# EAGLE design pierce-test-board5 (EAGLE 6.5.0)
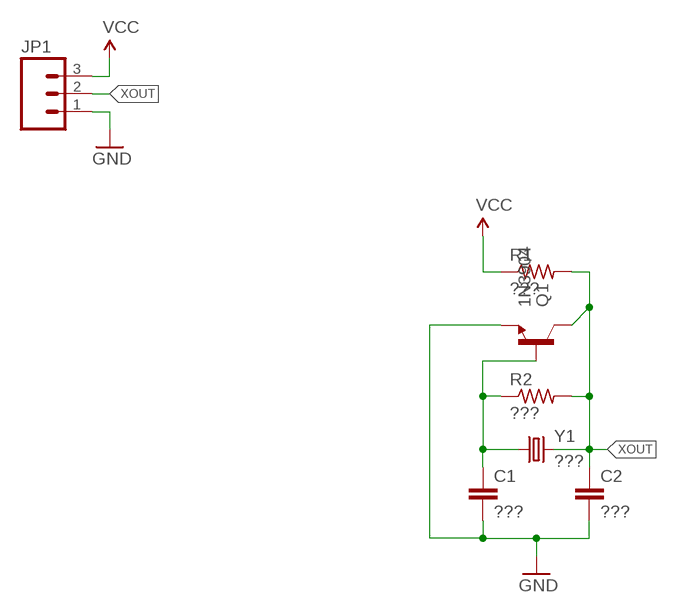
[diagram p0: schematic, sheet 1]

## Parts
C1  ???  CAPACITOR-CERAMIC025-024X044  [C025-024X044]
C2  ???  CAPACITOR-CERAMIC025-024X044  [C025-024X044]
JP1  M03PTH  [1X03]
Q1  1N3904  TRANSISTOR_NPNTO-92-AMMO-EBC  [TO-92-AMMO]
R1  ???  RESISTORPTH-AXIAL-5.08MM  [RESISTOR-AXIAL-PTH-5.08MM]
R2  ???  RESISTORPTH-AXIAL-5.08MM  [RESISTOR-AXIAL-PTH-5.08MM]
Y1  ???  CRYSTALHC49UV  [HC49U-V]

## Nets
GND: C1.2 C2.2 JP1.1 Q1.1(E)
N$2: C1.1 Q1.2(B) R2.P$1 Y1.1
VCC: JP1.3 R1.P$1
XOUT: C2.1 JP1.2 Q1.3(C) R1.P$2 R2.P$2 Y1.2

## Library data of the parts
C1 C2 = A_butts:CAPACITOR-CERAMIC: CAPACITOR, European symbol
JP1 = A_butts:M03: Header 3 Standard 3-pin 0.1" header. Use with straight break away headers (SKU : PRT-00116), right angle break away headers (PRT-00553), swiss pins (PRT-00743), machine pins (PRT-00117), and female headers (PRT-00115). Molex polarized connector foot print use with SKU : PRT-08232 with associated crimp pins and housings.
Q1 = A_butts:TRANSISTOR_NPN: Generic NPN BJT MMBT2222A - TRANS-08049 (SOT-23, 1A 40V) MPSA42 - TRANS-09116 (SOT-23, 500mA 300V) MMBT5088LT1G - TRANS-11160 (SOT-23, 50 mA 30V) BC547 - COM-08928 <http://www.sparkfun.com/products/8928> (TO-92 45V 100mA) (1.Collector 2.Base 3.Emitter) 2N3904 - COM-00521 <http://www.sparkfun.com/products/521> (TO-92 40V 200mA) (1.Emitter 2.Base 3.Collector) P2N2222A - COM-12852 <http://www.sparkfun.com/products/12852> (TO-92 40V 600mA) (1.Collector 2.Base 3.Emitter)
R1 R2 = A_butts:RESISTOR: RESISTOR, American symbol
Y1 = A_butts:CRYSTAL: Various standard crystals. Proven footprints. Spark Fun Electronics SKU : COM-00534

## Board
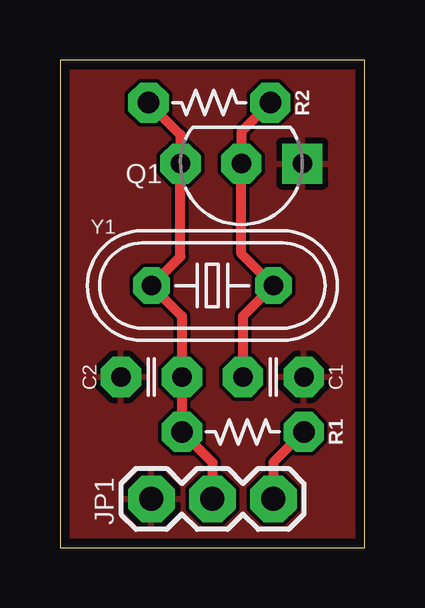
[diagram p1: board, top side]
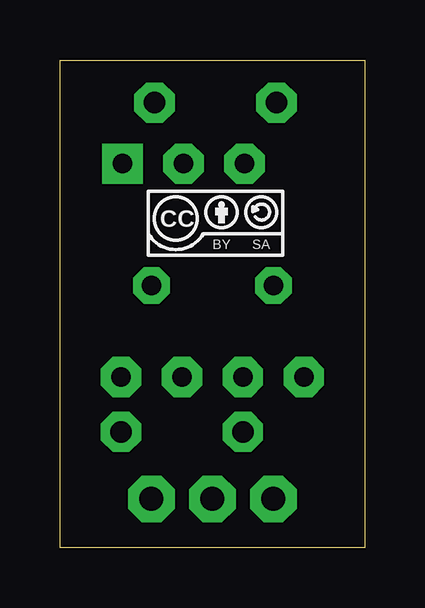
[diagram p2: board, bottom side, seen from below]

Size 12.7 x 20.32 mm. Coordinates in mm from the lower left corner, seen from the top.
Outline: 0,0 12.7,0 12.7,20.32 0,20.32 0,0
Copper layers (1*16): Top 0.0356mm / dielectric 1.5011mm / Bottom 0.0356mm
Design rules "LaenPCBOrder_2": minimum track width 6mil, minimum drill 13mil, track to track 6mil, track to pad 6mil, pad to pad 6mil, via to via 6mil, smd to smd 6mil, copper to edge 15mil, drill to drill 6mil, minimum pad ring 7mil, minimum via ring 7mil, stop-mask expansion 3mil, vias tented up to drill 20mil, thermal gap 10mil

### Footprints (pad centres in the part's own frame; a part is rotated, then mirrored left to right if it is on the bottom)
C025-024X044 = drill 0.813 pad 1.676 octagon: 1 -1.27,0; 2 1.27,0
1X03 = drill 1 pad 1.93 octagon: 1 0,0; 2 2.54,0; 3 5.08,0
TO-92-AMMO = drill 0.813 pad 1.676 square: 1 -2.54,0 | drill 0.813 pad 1.676 octagon: 2 0,0; 3 2.54,0
RESISTOR-AXIAL-PTH-5.08MM = drill 0.9 pad 1.676 octagon: P$1 -2.54,0; P$2 2.54,0
HC49U-V = drill 0.813 pad 1.524 octagon: 1 -2.54,0; 2 2.54,0

### Placement (x,y rotation side)
C1  8.89,7.11 0 top
C2  3.81,7.11 180 top
JP1  3.81,2.03 0 top
Q1  7.56,16 180 top
R1  7.62,4.83 180 top
R2  6.22,18.54 180 top
U$1  [CC-BY-SA-4.0-NO-URL]  7.87,13.72 0 bottom
Y1  6.35,10.92 180 top

### Tracks (layer width: path | path; a pad name or v marks a point on that pad's centre or on a via)
GND
  pour Top: 0,0 0,20.32 12.7,20.32 12.7,0
N$2
  Top 0.406: R2.P$1 7.56,17.34 Q1.2 7.56,12.26 Y1.1 7.62,9.65 C1.1
VCC
  Top 0.406: R1.P$1 8.89,3.56 JP1.3
XOUT
  Top 0.406: R2.P$2 5.02,17.21 Q1.3 5.02,12.13 Y1.2 5.08,9.65 C2.1 R1.P$2 6.35,3.56 JP1.2